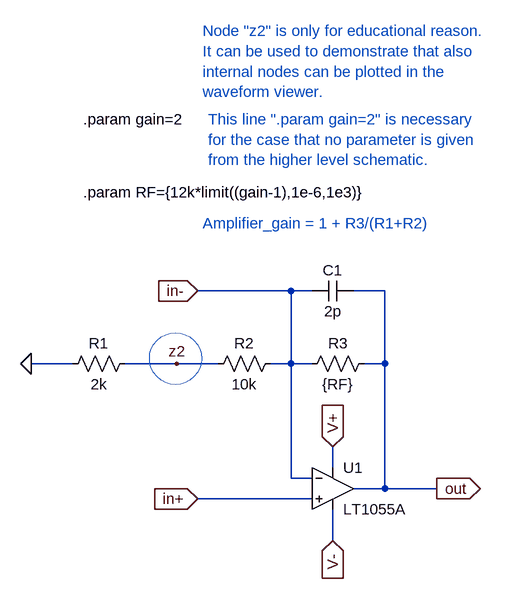
[diagram p0: schematic opamp_gain2.asc]
opamp_gain2.asc, the LTspice schematic file:
Version 4
SHEET 1 880 680
WIRE -208 48 -272 48
WIRE -48 48 -128 48
WIRE 16 48 -48 48
WIRE 128 -64 -16 -64
WIRE 128 48 96 48
WIRE 128 48 128 -64
WIRE 128 224 128 48
WIRE 160 -64 128 -64
WIRE 160 48 128 48
WIRE 160 224 128 224
WIRE 160 256 -16 256
WIRE 192 208 192 176
WIRE 192 320 192 272
WIRE 272 -64 224 -64
WIRE 272 48 240 48
WIRE 272 48 272 -64
WIRE 272 240 224 240
WIRE 272 240 272 48
WIRE 352 240 272 240
FLAG -272 48 0
FLAG 352 240 out
IOPIN 352 240 Out
FLAG -16 256 in+
IOPIN -16 256 In
FLAG 192 176 V+
IOPIN 192 176 In
FLAG 192 320 V-
IOPIN 192 320 In
FLAG -16 -64 in-
IOPIN -16 -64 In
FLAG -48 48 z2
SYMBOL Opamps\\LT1055A 192 176 R0
SYMATTR InstName U1
SYMBOL res 144 64 R270
WINDOW 0 32 56 VTop 0
WINDOW 3 0 56 VBottom 0
SYMATTR InstName R3
SYMATTR Value {RF}
SYMBOL res 0 64 R270
WINDOW 0 32 56 VTop 0
WINDOW 3 0 56 VBottom 0
SYMATTR InstName R2
SYMATTR Value 10k
SYMBOL cap 160 -48 R270
WINDOW 0 32 32 VTop 0
WINDOW 3 0 32 VBottom 0
SYMATTR InstName C1
SYMATTR Value 2p
SYMBOL res -224 64 R270
WINDOW 0 32 56 VTop 0
WINDOW 3 0 56 VBottom 0
SYMATTR InstName R1
SYMATTR Value 2k
TEXT -192 -216 Left 0 !.param RF={12k*limit((gain-1),1e-6,1e3)}
TEXT -192 -328 Left 0 !.param gain=2
TEXT -8 -168 Left 0 ;Amplifier_gain = 1 + R3/(R1+R2)
TEXT 0 -328 Left 0 ;This line ".param gain=2" is necessary \nfor the case that no parameter is given \nfrom the higher level schematic.
TEXT -8 -464 Left 0 ;Node "z2" is only for educational reason.\nIt can be used to demonstrate that also\ninternal nodes can be plotted in the \nwaveform viewer.
CIRCLE Normal -10 80 -90 0 2

The netlist it stands for:
* opamp_gain2.asc
XU1 in+ in- V+ V- out LT1055A  ; pins In+ In- V+ V- OUT
R3 in- out {RF}
R2 z2 in- 10k
C1 in- out 2p
R1 0 z2 2k
.param RF={12k*limit((gain-1),1e-6,1e3)}
.param gain=2
* Amplifier_gain = 1 + R3/(R1+R2)
* This line ".param gain=2" is necessary
* for the case that no parameter is given
* from the higher level schematic.
* Node "z2" is only for educational reason.
* It can be used to demonstrate that also
* internal nodes can be plotted in the
* waveform viewer.
.backanno
.end